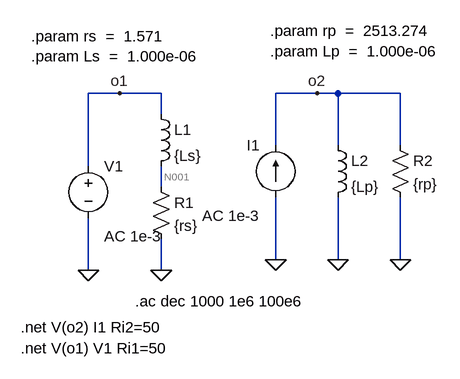
[diagram p0: schematic eje1.asc]
eje1.asc, the LTspice schematic file:
Version 4
SHEET 1 880 680
WIRE -112 32 -160 32
WIRE -48 32 -112 32
WIRE 192 32 128 32
WIRE 224 32 192 32
WIRE 320 32 224 32
WIRE -48 64 -48 32
WIRE 128 112 128 32
WIRE 224 112 224 32
WIRE 320 112 320 32
WIRE -160 144 -160 32
WIRE -48 176 -48 144
WIRE 128 288 128 192
WIRE 224 288 224 192
WIRE 320 288 320 192
WIRE -160 304 -160 224
WIRE -48 304 -48 256
FLAG -48 304 0
FLAG 224 288 0
FLAG 320 288 0
FLAG 128 288 0
FLAG -160 304 0
FLAG 192 32 o2
FLAG -112 32 o1
SYMBOL ind -64 48 R0
SYMATTR InstName L1
SYMATTR Value {Ls}
SYMBOL res -64 160 R0
SYMATTR InstName R1
SYMATTR Value {rs}
SYMBOL ind 208 96 R0
SYMATTR InstName L2
SYMATTR Value {Lp}
SYMBOL res 304 96 R0
SYMATTR InstName R2
SYMATTR Value {rp}
SYMBOL voltage -160 128 R0
WINDOW 123 24 124 Left 2
WINDOW 39 0 0 Left 0
SYMATTR Value2 AC 1e-3
SYMATTR InstName V1
SYMATTR Value ""
SYMBOL current 128 192 R180
WINDOW 0 24 80 Left 2
WINDOW 3 24 0 Left 2
WINDOW 123 24 -28 Left 2
WINDOW 39 0 0 Left 0
SYMATTR InstName I1
SYMATTR Value ""
SYMATTR Value2 AC 1e-3
TEXT -88 352 Left 2 !.ac dec 1000 1e6 100e6
TEXT -264 392 Left 2 !.net V(o2) I1 Ri2=50
TEXT -264 424 Left 2 !.net V(o1) V1 Ri1=50
TEXT -248 -56 Left 2 !.param rs  =  1.571 \n.param Ls  =  1.000e-06
TEXT 120 -64 Left 2 !.param rp  =  2513.274 \n.param Lp  =  1.000e-06

The netlist it stands for:
* eje1.asc
L1 o1 N001 {Ls}
R1 N001 0 {rs}
L2 o2 0 {Lp}
R2 o2 0 {rp}
V1 o1 0 AC 1e-3
I1 0 o2 AC 1e-3
.ac dec 1000 1e6 100e6
.net V(o2) I1 Ri2=50
.net V(o1) V1 Ri1=50
.param rs  =  1.571
.param Ls  =  1.000e-06
.param rp  =  2513.274
.param Lp  =  1.000e-06
.backanno
.end

* Results of the author's LTspice run, read from the files saved beside the schematic
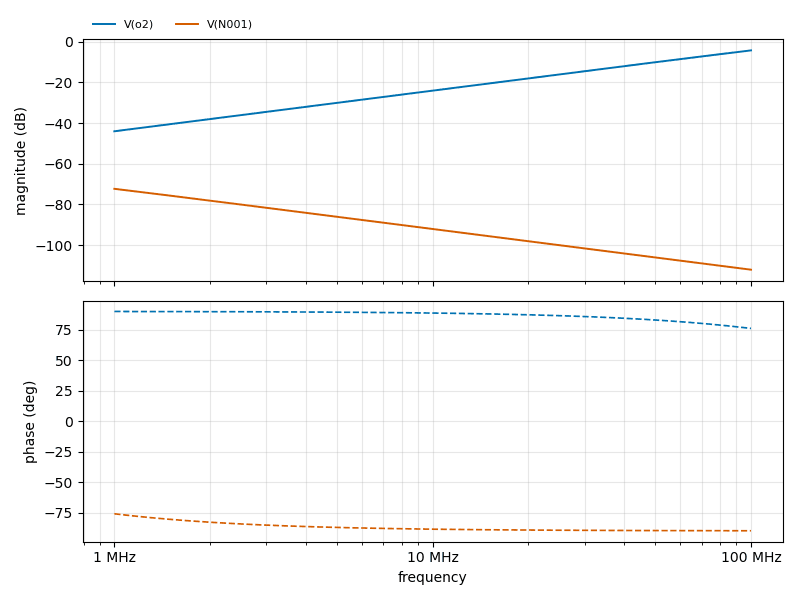
[diagram p1: AC Analysis of eje1.asc, plotted from the saved traces]
* AC Analysis, 1 run:
*   V(o2): -44.04 dB at 1 MHz, -4.30 dB at 100 MHz, peak -4.30 dB at 100 MHz, 3 dB below the peak at 69.63 MHz
*   V(N001): -72.30 dB at 1 MHz, -112.04 dB at 100 MHz, peak -72.30 dB at 1 MHz, 3 dB below the peak at 1.436 MHz